# Altium schematic sheet SenSor_ClockLed.SchDoc
size A4; SheetNumber: 8; SheetTotal: 8
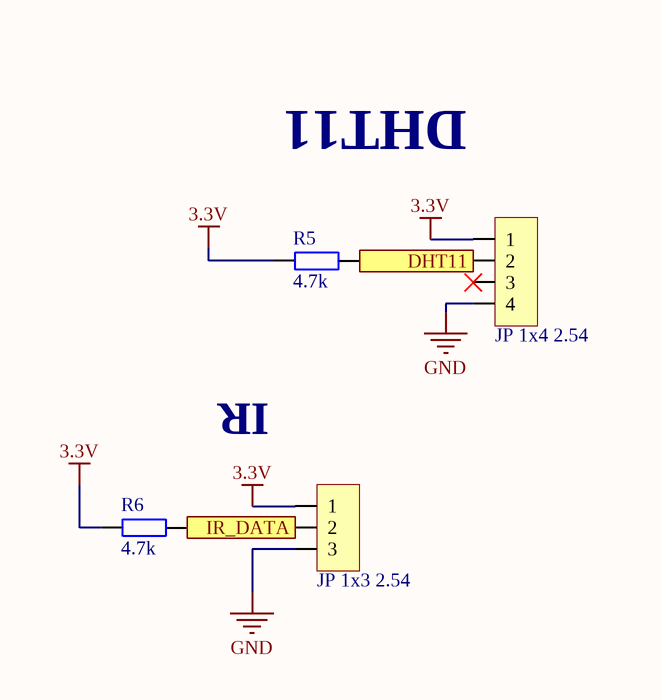
[diagram p0: SenSor_ClockLed.SchDoc]

## Parts
JP1  JP 1x4 2.54  [JP 1x4 DT]
JP3  JP 1x3 2.54  [JP 1x3 CT]
R5  4.7k  [tro smd 0805]
R6  4.7k  [tro smd 0805]

## Ports
DHT11, IR_DATA

## Nets
3.3V: JP1.1 JP3.1 R5.1 R6.1
GND: JP1.4 JP3.3
DHT11: JP1.2 R5.2 ; port DHT11
IR_DATA: JP3.2 R6.2 ; port IR_DATA

Not connected (* = marked no-connect by the designer): JP1 3*

## Notes on the sheet
- DHT11
- IR

## Library data of the parts
JP1 = JP 1x4 2.54 Duc Thang: Cắm; Ten_Linh_Kien: Jump Đơn Đực 2.54MM 1x40P Thẳng 11MM; Don_Vi: Con; Ma_Hang: MH000903; Ghi_Chu: *; Kieu_Chan: *; Chung_Loai: Cắm
JP3 = JP 1x3 2.54 Cai Thang: Cắm; Ten_Linh_Kien: Jump Đơn Cái 2.54MM 1x20P Thẳng; Don_Vi: Con; Ma_Hang: MH004006; Ghi_Chu: *; Kieu_Chan: *; Chung_Loai: Cắm
R5 R6 = Tro 0805 5% 4.7k: Dán; Don_Vi: Con; So_Chan: 2; Ten_Linh_Kien: Trở 0805 5% 4.7k; Ma_Hang: MH005307; Chung_Loai: Dán; Kieu_Chan: *